# Altium schematic sheet SH7 - MICROCONTROLLER.SchDoc: Power Distribution Board Rev2 - MCU
size Letter; DrawnBy: Cindy Li; Organization: Altium Limited; Address1: L3, 12a Rodborough Rd; Address2: Frenchs Forest; Address3: NSW; Address4: Australia 2086
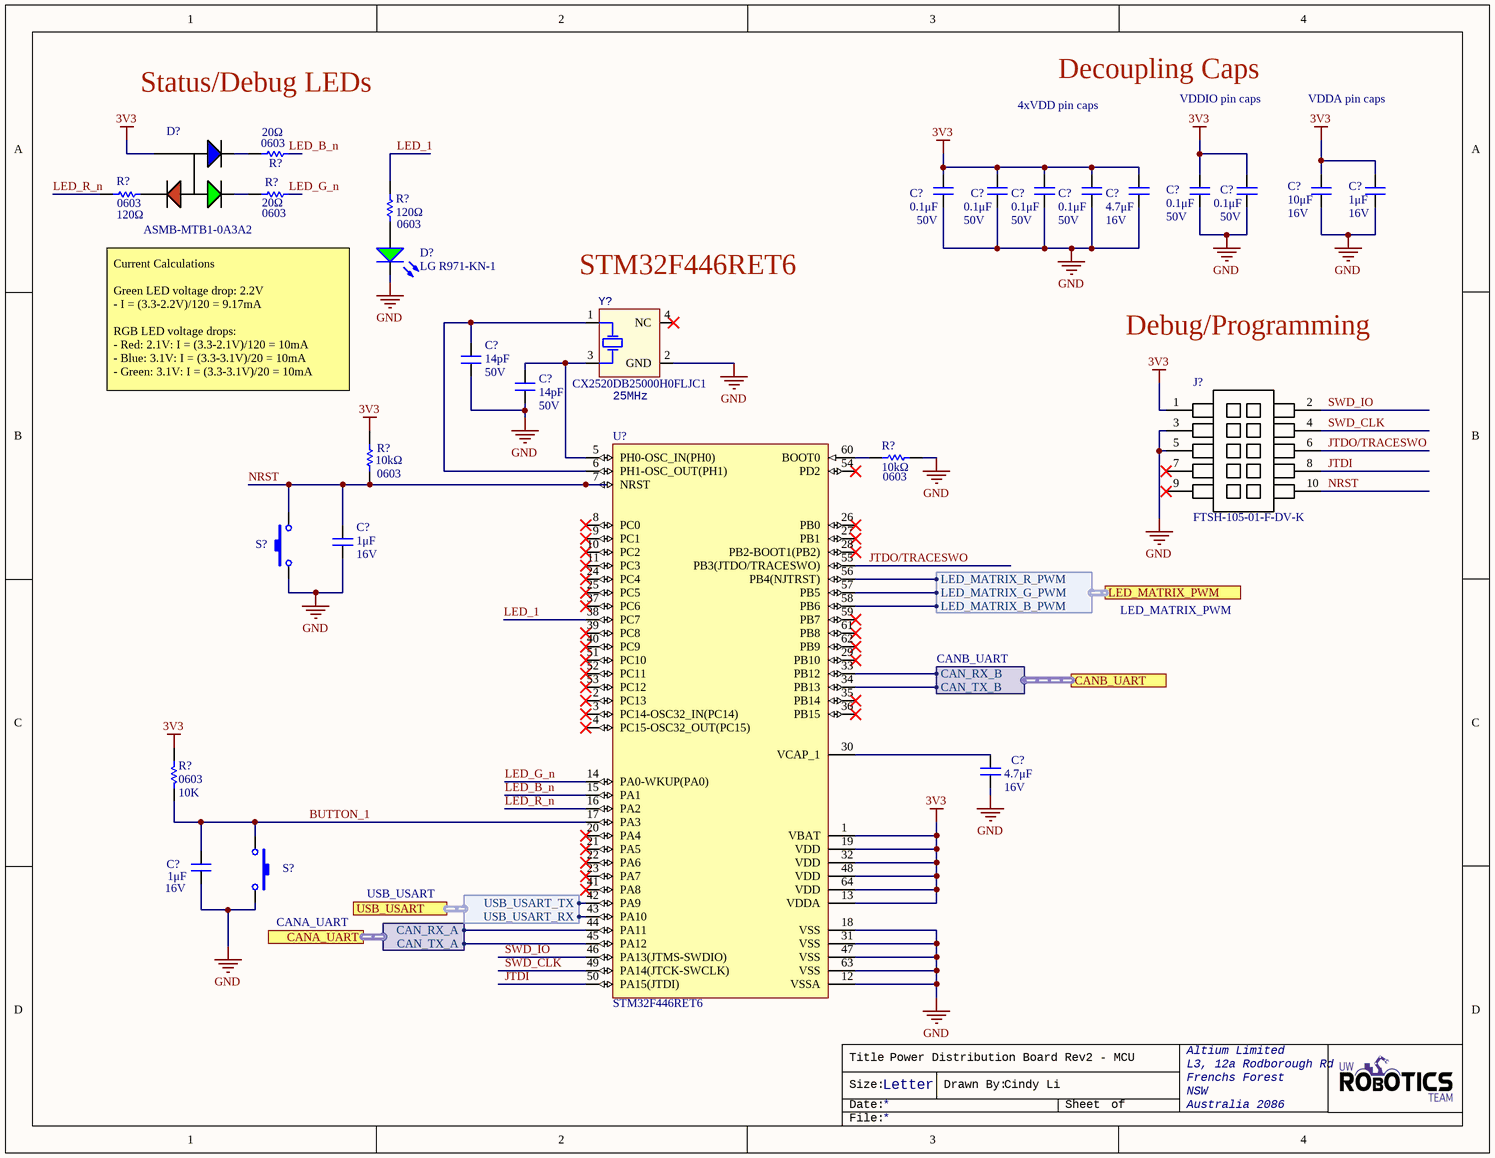
[diagram p0: SH7 - MICROCONTROLLER.SchDoc]

## Parts
(Parts that share a designator on the sheet are numbered #1, #2 ... from top to bottom, then left to right.)
C?#1  value 0.1μF  Voltage Rating: 50V  [CAP0603]  (hidden comment: CAP_0.1uF_50V_0603)
C?#2  value 0.1μF  Voltage Rating: 50V  [CAP0603]  (hidden comment: CAP_0.1uF_50V_0603)
C?#3  value 0.1μF  Voltage Rating: 50V  [CAP0603]  (hidden comment: CAP_0.1uF_50V_0603)
C?#4  value 0.1μF  Voltage Rating: 50V  [CAP0603]  (hidden comment: CAP_0.1uF_50V_0603)
C?#5  value 4.7μF  Voltage Rating: 16V  [CAP2012]  (hidden comment: CAP_4.7uF_16V_0805)
C?#6  value 0.1μF  Voltage Rating: 50V  [CAP0603]  (hidden comment: CAP_0.1uF_50V_0603)
C?#7  value 0.1μF  Voltage Rating: 50V  [CAP0603]  (hidden comment: CAP_0.1uF_50V_0603)
C?#8  value 10μF  Voltage Rating: 16V  [CAP0603]  (hidden comment: CAP_10nF_0603)
C?#9  value 1μF  Voltage Rating: 16V  [CAP0603]  (hidden comment: CAP_1uF_16V_0603)
C?#10  value 14pF  Voltage Rating (DC): 50V  [CAPC0603(1608)55_N]  (hidden comment: CL10C140JB8NNNC)
C?#11  value 14pF  Voltage Rating (DC): 50V  [CAPC0603(1608)55_N]  (hidden comment: CL10C140JB8NNNC)
C?#12  value 1μF  Voltage Rating: 16V  [CAP2012]  (hidden comment: CAP_1uF_16V_0805)
C?#13  value 4.7μF  Voltage Rating: 16V  [CAP2012]  (hidden comment: CAP_4.7uF_16V_0805)
C?#14  value 1μF  Voltage Rating: 16V  [CAP2012]  (hidden comment: CAP_1uF_16V_0805)
D?#1  Manufacturer Part Number 1: ASMB-MTB1-0A3A2  [LED_RGB]  (hidden comment: LED_RGB)
D?#2  LG R971-KN-1  [LED_0805_GREEN]
J?  Manufacturer Part Number 1: FTSH-105-01-F-DV-K  [FTSH-105-01-F-DV-K-P-TR]  (hidden comment: CON_PROGRAMMING)
R?#1  value 20Ω  Case Code (Imperial): 0603  [RESC0603(1608)_N]  (hidden comment: RES_20Ω_0603)
R?#2  value 120Ω  Case Code (Imperial): 0603  [RESC0603(1608)_N]  (hidden comment: RES_120Ω_0603)
R?#3  value 20Ω  Case Code (Imperial): 0603  [RESC0603(1608)_N]  (hidden comment: RES_20Ω_0603)
R?#4  value 120Ω  Case Code (Imperial): 0603  [RESC0603(1608)_N]  (hidden comment: RES_120Ω_0603)
R?#5  value 10kΩ  Case Code (Imperial): 0603  [RESC0603(1608)_N]  (hidden comment: RES_10kΩ_0603)
R?#6  value 10kΩ  Case Code (Imperial): 0603  [RESC0603(1608)_N]  (hidden comment: RES_10kΩ_0603)
R?#7  value 10K  Package: 0603  [RESC0603(1608)_N]  (hidden comment: RES_10K_0603)
S?#1  SW_TACTILE  [B3U-1000P]  (value not drawn)
S?#2  SW_TACTILE  [B3U-1000P]  (value not drawn)
U?  STM32F446RET6  [STM-LQFP64_L]
Y?  Manufacturer Part Number 1: CX2520DB25000H0FLJC1  Frequency: 25MHz  [SOIC254P1016X440-4N]  (hidden comment: CRYSTAL_25MHZ)

## Ports
CANA_UART (harness CANA_UART), CANB_UART (harness CANB_UART), LED_MATRIX_PWM (harness LED_MATRIX_PWM), USB_USART (harness USB_USART)

## Harnesses
CANA_UART: CAN_RX_A, CAN_TX_A
CANB_UART: CAN_RX_B, CAN_TX_B
LED_MATRIX_PWM: LED_MATRIX_R_PWM, LED_MATRIX_G_PWM, LED_MATRIX_B_PWM
USB_USART: USB_USART_TX, USB_USART_RX

## Nets
3V3: C?#1.2 C?#2.2 C?#3.2 C?#4.2 C?#5.2 C?#6.2 C?#7.2 C?#8.2 C?#9.2 D?#1.4(COMMON_ANODE) J?.1 R?#5.2 R?#7.1 U?.1(VBAT) U?.13(VDDA) U?.19(VDD) U?.32(VDD) U?.48(VDD) U?.64(VDD)
GND: C?#1.1 C?#2.1 C?#3.1 C?#4.1 C?#5.1 C?#6.1 C?#7.1 C?#8.1 C?#9.1 C?#10.1 C?#11.1 C?#12.1 C?#13.1 C?#14.1 D?#2.2(K) J?.3 J?.5 R?#6.2 S?#1.1 S?#2.1 U?.12(VSSA) U?.18(VSS) U?.31(VSS) U?.47(VSS) U?.63(VSS) Y?.2(GND)
BUTTON_1: C?#14.2 R?#7.2 S?#2.2 U?.17(PA3)
JTDI: J?.8 U?.50(PA15(JTDI))
JTDO/TRACESWO: J?.6 U?.55(PB3(JTDO/TRACESWO))
LED_1: R?#4.1 U?.38(PC7)
LED_B_n: R?#1.2 U?.15(PA1)
LED_G_n: R?#3.2 U?.14(PA0-WKUP(PA0))
LED_R_n: R?#2.1 U?.16(PA2)
NRST: C?#12.2 J?.10 R?#5.1 S?#1.2 U?.7(NRST)
SWD_CLK: J?.4 U?.49(PA14(JTCK-SWCLK))
SWD_IO: J?.2 U?.46(PA13(JTMS-SWDIO))
NetC?#10_2: C?#10.2 U?.6(PH1-OSC_OUT(PH1)) Y?.1(HOT)
NetC?#11_2: C?#11.2 U?.5(PH0-OSC_IN(PH0)) Y?.3(HOT)
NetC?#13_2: C?#13.2 U?.30(VCAP_1)
NetD?#1_1: D?#1.1(CATHODE_(RED)) R?#2.2
NetD?#1_2: D?#1.2(CATHODE_(GREEN)) R?#3.1
NetD?#1_3: D?#1.3(CATHODE_(BLUE)) R?#1.1
NetD?#2_1: D?#2.1(A) R?#4.2
NetR?#6_1: R?#6.1 U?.60(BOOT0)
NetU?_33: U?.33(PB12) ; port CANB_UART.CAN_RX_B
NetU?_34: U?.34(PB13) ; port CANB_UART.CAN_TX_B
NetU?_42: U?.42(PA9) ; port USB_USART.USB_USART_TX
NetU?_43: U?.43(PA10) ; port USB_USART.USB_USART_RX
NetU?_44: U?.44(PA11) ; port CANA_UART.CAN_RX_A
NetU?_45: U?.45(PA12) ; port CANA_UART.CAN_TX_A
NetU?_56: U?.56(PB4(NJTRST)) ; port LED_MATRIX_PWM.LED_MATRIX_R_PWM
NetU?_57: U?.57(PB5) ; port LED_MATRIX_PWM.LED_MATRIX_G_PWM
NetU?_58: U?.58(PB6) ; port LED_MATRIX_PWM.LED_MATRIX_B_PWM

Not connected (* = marked no-connect by the designer): J? 7* 9*; U? 2(PC13)* 3(PC14-OSC32_IN(PC14))* 4(PC15-OSC32_OUT(PC15))* 8(PC0)* 9(PC1)* 10(PC2)* 11(PC3)* 20(PA4)* 21(PA5)* 22(PA6)* 23(PA7)* 24(PC4)* 25(PC5)* 26(PB0)* 27(PB1)* 28(PB2-BOOT1(PB2))* 29(PB10)* 35(PB14)* 36(PB15)* 37(PC6)* 39(PC8)* 40(PC9)* 41(PA8)* 51(PC10)* 52(PC11)* 53(PC12)* 54(PD2)* 59(PB7)* 61(PB8)* 62(PB9)*; Y? 4(NC)*

## Notes on the sheet
- Status/Debug LEDs
- Decoupling Caps
- VDDIO pin caps
- VDDA pin caps
- 4xVDD pin caps
- (near Y?) STM32F446RET6
- Debug/Programming
- Current Calculations
  Green LED voltage drop: 2.2V
  - I = (3.3-2.2V)/120 = 9.17mA
  RGB LED voltage drops:
  - Red: 2.1V: I = (3.3-2.1V)/120 = 10mA
  - Blue: 3.1V: I = (3.3-3.1V)/20 = 10mA
  - Green: 3.1V: I = (3.3-3.1V)/20 = 10mA
- Title
- Size:
- Date:
- Letter
- Drawn By:
- Sheet
- of
- File:

## Library data of the parts
C?#1-C?#4 C?#6 C?#7 = CAP_0.1uF_50V_0603: CAP CER 0.1UF 50V X7R 0603; Manufacturer Part Number 1: CC0603KRX7R9BB104; Manufacturer 1: Yageo; Dimensions: 0.063" L x 0.031" W (1.60mm x 0.80mm); Package: 0603 (1608 Metric); Temperature Coefficient: X7R; Supplier Part Number 1: 311-1344-1-ND; Supplier 1: Digi-Key; Mount: Surface Mount; Case Code (Imperial): 0603; Case Code (Metric): 1608; Dielectric: X7R
C?#5 C?#13 = CAP_4.7uF_16V_0805: CAP CER 4.7UF 16V X5R 0805; Manufacturer Part Number 1: CL21A475KOFNNNE; Manufacturer 1: Samsung Electro-Mechanics; Tolerance: 10%; Package: 0805 (2012 Metric); Supplier Part Number 1: 1276-1065-1-ND; Supplier 1: Digi-Key; Mount: Surface Mount; Case Code (Imperial): 0805; Case Code (Metric): 2012; Dielectric: X5R; Min Operating Temperature: -55°C; Max Operating Temperature: 85°C; Termination: SMD/SMT
C?#8 = CAP_10nF_0603: CAP CER 10000PF 16V X7R 0603; Manufacturer Part Number 1: CC0603KRX7R7BB103; Manufacturer 1: Yageo; Dimensions: 0.063" L x 0.031" W (1.60mm x 0.80mm); Package: 0603 (1608 Metric); Temperature Coefficient: X7R; Supplier Part Number 1: 311-3369-1-ND; Supplier 1: Digi-Key; Mount: Surface Mount; Case Code (Imperial): 0603; Case Code (Metric): 1608; Dielectric: X7R
C?#9 = CAP_1uF_16V_0603: CAP CER 1UF 16V Y5V 0603; Manufacturer Part Number: CC0603ZRY5V7BB105; Manufacturer 1: Yageo; Dimensions: 0.063" L x 0.031" W (1.60mm x 0.80mm); Package: 0603 (1608 Metric); Temperature Coefficient: Y5V; Supplier Part Number 1: 311-1372-1-ND; Supplier 1: Digi-Key; Mount: Surface Mount; Case Code (Imperial): 0603; Case Code (Metric): 1608; Manufacturer Part Number 1: CC0603ZRY5V7BB105; Dielectric: Y5V
C?#10 C?#11 = CL10C140JB8NNNC: Cap Ceramic 14pF 50V C0G 5% SMD 0603 125C Cardboard T/R; Manufacturer 1: Samsung; Voltage Rating: 50V; Supplier Part Number 1: 1276-2187-1-ND; Supplier 1: Digi-Key; Manufacturer Part Number 1: CL10C140JB8NNNC; Stock 1: 187088; Pricing 1: 1=0.10000, 10=0.06700, 100=0.02980, 500=0.02130, 1000=0.01673 (USD); RoHS: Yes; Mount: Surface Mount; Case/Package: 0603; Case Code (Metric): 1608; Case Code (Imperial): 0603; Min Operating Temperature: -55°C; Max Operating Temperature: 125°C; Tolerance: 5%; Package Quantity: 1; Packaging: Tape and Reel; Dielectric: C0G; Length: 1.6mm; Height: 0.8mm; Width: 0.031inch; Depth: 0.8mm; Thickness: 0.035inch; Radiation Hardening: No; ComponentLink1URL: https://datasheet.ciiva.com/25782/cl10c140jb8nnnc-25782947.pdf?src-supplier=Digi-Key; ComponentLink1Description: https://datasheet.ciiva.com/25782/cl10c140jb8nnnc-25782947.pdf?src-supplier=Digi-Key; Capacitance: 14pF
C?#12 C?#14 = CAP_1uF_16V_0805: CAP CER 1UF 16V X7R 0805; Manufacturer 1: Yageo; Manufacturer Part Number 1: CC0805KKX7R7BB105; Tolerance: 10%; Mount: Surface Mount; Case Code (Metric): 2012; Case Code (Imperial): 0805; Min Operating Temperature: -55°C; Max Operating Temperature: 125°C; Dielectric: X7R; Termination: SMD/SMT; Supplier 1: Digi-Key; Supplier Part Number 1: 311-1365-1-ND; Package: 0805 (2012 Metric)
D?#1 = LED_RGB: LED RGB DIFFUSED 4PLCC SMD; Manufacturer 1: Broadcom; Color: Blue,Green,Red; Lens Color: White; Viewing Angle: 115°; Lens Style: Round; Luminous Intensity: 350mcd; Dominant Wavelength: 470nm; Forward Voltage: 3.1V; Test Current: 20mA; Supplier 1: Digi-Key; Mount: Surface Mount; Case/Package: PLCC; Number of Pins: 4; Lens Transparency: Diffused; Length: 3.2mm; Height: 1.9mm; Width: 2.8mm; REACH SVHC: No SVHC; Supplier Part Number 1: 516-3280-1-ND
D?#2 = DIO_LED_G: LED GREEN DIFFUSED 0805 SMD; Manufacturer 1: OSRAM; Forward Voltage Drop: 2.2V; Package: 0805 (2012 Metric); Supplier Part Number 1: 475-1410-1-ND; Supplier 1: Digi-Key; Manufacturer Part Number 1: LG R971-KN-1; Mount: Surface Mount
J? = CON_PROGRAMMING: Board Connector, 10 Contact(s), 2 Row(s), Male, Straight, 0.05 inch Pitch, Surface Mount Terminal, Locking; Manufacturer 1: Samtec; Number of Contacts: 10; Connector Type: Male Pin; Max Current Rating: 1.75A; Pitch: 1.27mm; Supplier 1: Digi-Key; RoHS: Yes; Category: Headers and Wire Housings; Stock 1: 19926; Pricing 1: 1=2.90000, 10=2.78400, 100=2.32000, 500=1.97200, 1000=1.68200, 5000=1.50800 (USD); Mount: Surface Mount; Contact Plating: Gold; Contact Material: Copper,Bronze; Housing Color: Black; Housing Material: Polymer; Color: Black; Min Operating Temperature: -55°C; Max Operating Temperature: 125°C; Number of Rows: 2; Termination: Solder; Packaging: Rail/Tube; Orientation: Straight; Package Quantity: 1; Number of Positions: 10; Length: 15.2mm; Height: 3.3mm; Depth: 3.43mm; Row Spacing: 0.05inch; Contact Mating Length: 0.12inch; Radiation Hardening: No; Lead Free: Lead Free; ComponentLink1URL: https://datasheet.ciiva.com:443/pdfs/VipMasterIC/IC/SAMI/SAMI-S-A0003531380/SAMI-S-A0003531380-1.pdf?src-supplier=IHS+Markit; ComponentLink1Description: https://datasheet.ciiva.com:443/pdfs/VipMasterIC/IC/SAMI/SAMI-S-A0003531380/SAMI-S-A0003531380-1.pdf?src-supplier=IHS+Markit; ComponentLink2URL: https://datasheet.ciiva.com/19461/2046846-19461026.pdf?src-supplier=Jameco; ComponentLink2Description: https://datasheet.ciiva.com/19461/2046846-19461026.pdf?src-supplier=Jameco; ComponentLink3URL: https://datasheet.ciiva.com/16657/ftsh-mt-16657371.pdf?src-supplier=Avnet+Europe; ComponentLink3Description: https://datasheet.ciiva.com/16657/ftsh-mt-16657371.pdf?src-supplier=Avnet+Europe; ComponentLink4URL: https://datasheet.ciiva.com/15195/getdatasheetpartid-133463-15195260.pdf?src-supplier=Verical; ComponentLink4Description: https://datasheet.ciiva.com/15195/getdatasheetpartid-133463-15195260.pdf?src-supplier=Verical; ComponentLink5URL: https://datasheet.ciiva.com/738/ftsh-1xx-xx-xxx-dv-xxx-mkt-738998.pdf?src-supplier=Digi-Key; ComponentLink5Description: https://datasheet.ciiva.com/738/ftsh-1xx-xx-xxx-dv-xxx-mkt-738998.pdf?src-supplier=Digi-Key; ComponentLink6URL: https://datasheet.ciiva.com/10245/ftsh-mt-10245273.pdf?src-supplier=Avnet; ComponentLink6Description: https://datasheet.ciiva.com/10245/ftsh-mt-10245273.pdf?src-supplier=Avnet; Supplier Part Number 1: SAM8796-ND
R?#1 R?#3 = RES_20Ω_0603: RES SMD 20 OHM 5% 1/10W 0603; Manufacturer 1: Yageo; Manufacturer Part Number 1: RC0603JR-0720RL; Package: 0603 (1608 Metric); Dimensions: 0.063" L x 0.031" W (1.60mm x 0.80mm); Tolerance: 5%; Supplier Part Number 1: 311-20GRCT-ND; Supplier 1: Digi-Key; Mount: Surface Mount; Case Code (Metric): 1608
R?#2 R?#4 = RES_120Ω_0603: RES SMD 120 OHM 5% 1/10W 0603; Manufacturer 1: Yageo; Manufacturer Part Number 1: RC0603JR-07120RL; Package: 0603 (1608 Metric); Dimensions: 0.063" L x 0.031" W (1.60mm x 0.80mm); Tolerance: 5%; Supplier Part Number 1: 311-120GRCT-ND; Supplier 1: Digi-Key; Mount: Surface Mount; Case Code (Metric): 1608
R?#5 R?#6 = RES_10kΩ_0603: RES SMD 10K OHM 5% 1/10W 0603; Manufacturer 1: Yageo; Manufacturer Part Number 1: RC0603JR-0710KL; Package: 0603 (1608 Metric); Dimensions: 0.063" L x 0.031" W (1.60mm x 0.80mm); Tolerance: 5%; Supplier Part Number 1: 311-10KGRCT-ND; Supplier 1: Digi-Key; Mount: Surface Mount; Case Code (Metric): 1608
R?#7 = RES_10K_0603: RES SMD 10K OHM 5% 1/10W 0603; Manufacturer: Yageo; MPN: RC0603JR-0710KL; Dimensions: 0.063" L x 0.031" W (1.60mm x 0.80mm); Tolerance: 5%; Supplier Part Number 1: 311-10KGRCT-ND; Supplier 1: Digi-Key
S?#1 S?#2 = SW_TACTILE: Tactile Switch (Grey); Manufacturer 1: Omron Electronics Inc-EMC Div; Manufacturer Part Number 1: B3U-1000P; Supplier 1: Digi-Key; Supplier Part Number 1: SW1020CT-ND; Mount: Surface Mount
U? = MCU_STM32F446RET6: ARM Cortex-M4 32-bit MCU+FPU, 512 KB Flash, 128 KB Internal RAM, 50 I/Os, 64-Pin LQFP, -40 to 85 degC, Tray; I/Os (High Current): 50; Supply Voltage(Vcc) min (V): 1.7; Operating Frequency(F) (Processor speed) (MHz): 180; D/A Converter: 2; Internal RAM Size (kB): 128; FLASH Size (Prog) (kB): 512; Core: ARM Cortex-M4; ComponentLink1Description: Manufacturer URL; Package Reference: 64-Pin Low-profile Quad Flat Package, Body 10 x 10 mm, Pitch 0.5 mm; ComponentLink2URL: http://www.st.com/st-web-ui/static/active/en/resource/technical/document/datasheet/DM00141306.pdf; Packing: Tray; DatasheetVersion: Rev. 6; ComponentLink1URL: http://www.st.com/; ComponentLink2Description: Datasheet; Package Description: LQFP64; Mounting Technology: Surface Mount; Supplier Part Number 1: 497-15376-ND; Supplier 1: Digi-Key
Y? = CRYSTAL_25MHZ: CRYSTAL 25.0000MHZ 12PF SMD; Manufacturer 1: Kyocera AVX; ESR (Equivalent Series Resistance): 80R; Frequency Stability: 15ppm; Frequency Tolerance: 10ppm; Supplier 1: Digi-Key; Supplier Part Number 1: 1253-1724-1-ND; Mount: Surface Mount; Case/Package: SMD/SMT; Min Operating Temperature: -30°C; Max Operating Temperature: 85°C; Load Capacitance: 12pF; Length: 0.098inch; Height: 0.022inch; Width: 0.079inch; Ratings: AEC-Q200